# Altium schematic sheet Power.SchDoc: Flyer_Power
size A4
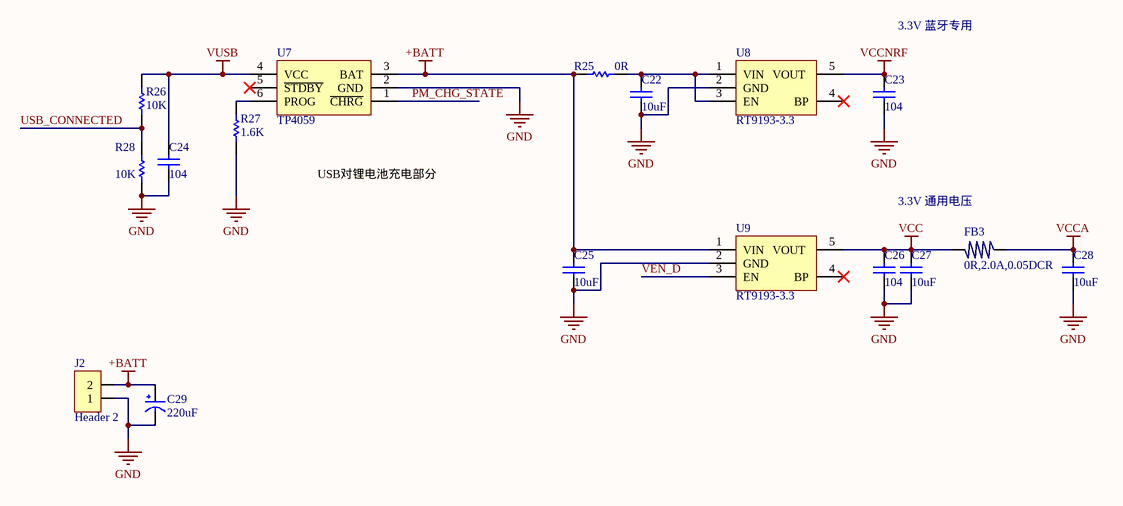
[diagram p0: Power.SchDoc]

## Parts
C22  10uF  [C0603]
C23  104  [C0603]
C24  104  [C0603]
C25  10uF  [C0603]
C26  104  [C0603]
C27  10uF  [C0603]
C28  10uF  [C0603]
C29  220uF  [TAJ-A]
FB3  0R,2.0A,0.05DCR  [L0603]
J2  Header 2  [HDR1X2-2MM]
R25  0R  [R0603]
R26  10K  [R0603]
R27  1.6K  [R0603]
R28  10K  [R0603]
U7  TP4059  [SOT23-6]
U8  RT9193-3.3  [SOT-23-5]
U9  RT9193-3.3  [SOT-23-5]

## Nets
+BATT: C25.2 C29.1(VCC) J2.2 R25.1 U7.3(BAT) U9.1(VIN)
GND: C22.1 C23.1 C24.1 C25.1 C26.1 C27.1 C28.1 C29.2(GND) J2.1 R27.1 R28.1 U7.2(GND) U8.2(GND) U9.2(GND)
VCC: C26.2 C27.2 FB3.2 U9.5(VOUT)
VCCA: C28.2 FB3.1
VCCNRF: C23.2 U8.5(VOUT)
VUSB: C24.2 R26.2 U7.4(VCC)
PM_CHG_STATE: U7.1(~{CHRG})
USB_CONNECTED: R26.1 R28.2
VEN_D: U9.3(EN)
NetC22_2: C22.2 R25.2 U8.1(VIN) U8.3(EN)
NetR27_2: R27.2 U7.6(PROG)

Not connected (* = marked no-connect by the designer): U7 5(~{STDBY})*; U8 4(BP)*; U9 4(BP)*

## Notes on the sheet
- 3.3V 蓝牙专用
- USB对锂电池充电部分
- 3.3V 通用电压
- Title
- Size:
- Date:
- A4
- Number:
- Time:
- Revision:
- Sheet
- of
- File:

## Library data of the parts
C22-C28 = C0603: 电容; Published: 8-Jun-2000; LatestRevisionDate: 17-Jul-2002; LatestRevisionNote: Re-released for DXP Platform.; PackageReference: RAD-0.3; Publisher: Altium Limited; PackageDescription: Radial Cap, Thru-Hole; 2 Leads; 0.3 in Pin Spacing; UnitPrice: 0.02
C29 = C Pol: 极性电容
FB3 = L-Beads: 磁珠
J2 = Header 2: Header, 2-Pin; LatestRevisionDate: 17-Jul-2002; LatestRevisionNote: Re-released for DXP Platform.; Publisher: Altium Limited
R25-R28 = RES0603: 电阻; Published: 8-Jun-2000; LatestRevisionDate: 17-Jul-2002; LatestRevisionNote: Re-released for DXP Platform.; PackageReference: AXIAL-0.3; Publisher: Altium Limited; PackageDescription: Axial Device, Thru-Hole; 2 Leads; 0.3 in Pin Spacing
U7 = TP4059: 锂电池充电IC